# EAGLE design sensor_luz (EAGLE 7.1.0)
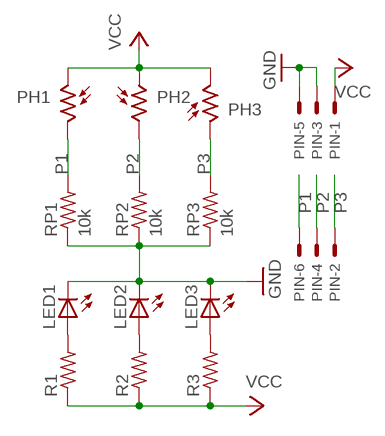
[diagram p0: schematic, sheet 1]

## Parts
LED1  LED3MM  [LED3MM]
LED2  LED3MM  [LED3MM]
LED3  LED3MM  [LED3MM]
PH1  VT20N4  [TO46-VT200]
PH2  VT20N4  [TO46-VT200]
PH3  VT20N4  [TO46-VT200]
PIN  332-06  [332-06]
R1  R-US_0207/7  [0207/7]
R2  R-US_0207/7  [0207/7]
R3  R-US_0207/7  [0207/7]
RP1  10k  R-US_0207/7  [0207/7]
RP2  10k  R-US_0207/7  [0207/7]
RP3  10k  R-US_0207/7  [0207/7]

## Nets
GND: LED1.K(C) LED2.K(C) LED3.K(C) PIN.3 PIN.5 RP1.1 RP2.1 RP3.1
N$1: LED1.A R1.2
N$2: LED2.A R2.2
N$3: LED3.A R3.2
P1: PH1.2 PIN.6 RP1.2
P2: PH2.2 PIN.4 RP2.2
P3: PH3.1 PIN.2 RP3.2
VCC: PH1.1 PH2.1 PH3.2 PIN.1 R1.1 R2.1 R3.1

## Library data of the parts
LED1-LED3 = led:LED: LED OSRAM: - CHIPLED LG R971, LG N971, LY N971, LG Q971, LY Q971, LO R971, LY R971 LH N974, LH R974 LS Q976, LO Q976, LY Q976 LO Q996 - Hyper CHIPLED LW Q18S LB Q993, LB Q99A, LB R99A - SideLED LS A670, LO A670, LY A670, LG A670, LP A670 LB A673, LV A673, LT A673, LW A673 LH A674 LY A675 LS A676, LA A676, LO A676, LY A676, LW A676 LS A679, LY A679, LG A679 - Hyper Micro SIDELED® LS Y876, LA Y876, LO Y876, LY Y876 LT Y87S - SmartLED LW L88C, LW L88S LB L89C, LB L89S, LG L890 LS L89K, LO L89K, LY L89K LS L896, LA L896, LO L896, LY L896 - TOPLED LS T670, LO T670, LY T670, LG T670, LP T670 LSG T670, LSP T670, LSY T670, LOP T670, LYG T670 LG T671, LOG T671, LSG T671 LB T673, LV T673, LT T673, LW T673 LH T674 LS T676, LA T676, LO T676, LY T676, LB T676, LH T676, LSB T676, LW T676 LB T67C, LV T67C, LT T67C, LS T67K, LO T67K, LY T67K, LW E67C LS E67B, LA E67B, LO E67B, LY E67B, LB E67C, LV E67C, LT E67C LW T67C LS T679, LY T679, LG T679 LS T770, LO T770, LY T770, LG T770, LP T770 LB T773, LV T773, LT T773, LW T773 LH T774 LS E675, LA E675, LY E675, LS T675 LS T776, LA T776, LO T776, LY T776, LB T776 LHGB T686 LT T68C, LB T68C - Hyper Mini TOPLED® LB M676 - Mini TOPLED Santana® LG M470 LS M47K, LO M47K, LY M47K Source: http://www.osram.convergy.de LUXEON: - LUMILED® LXK2-PW12-R00, LXK2-PW12-S00, LXK2-PW14-U00, LXK2-PW14-V00 LXK2-PM12-R00, LXK2-PM12-S00, LXK2-PM14-U00 LXK2-PE12-Q00, LXK2-PE12-R00, LXK2-PE12-S00, LXK2-PE14-T00, LXK2-PE14-U00 LXK2-PB12-K00, LXK2-PB12-L00, LXK2-PB12-M00, LXK2-PB14-N00, LXK2-PB14-P00, LXK2-PB14-Q00 LXK2-PR12-L00, LXK2-PR12-M00, LXK2-PR14-Q00, LXK2-PR14-R00 LXK2-PD12-Q00, LXK2-PD12-R00, LXK2-PD12-S00 LXK2-PH12-R00, LXK2-PH12-S00 LXK2-PL12-P00, LXK2-PL12-Q00, LXK2-PL12-R00 Source: www.luxeon.com KINGBRIGHT: KA-3528ASYC Source: www.kingbright.com
PH1-PH3 = photo-elements:VT2*: Photoconductive Cell VT200 Series Source: http://optoelectronics.perkinelmer.com/content/Datasheets/DTS_vt200seriesdatasheet.pdf
PIN = con-garry:332-06: 6 Pin - 2mm Dual Row Source: www.mpe-connector.de / garry_shortform_2012.pdf
R1-R3 RP1-RP3 = rcl:R-US_: RESISTOR, American symbol

## Board
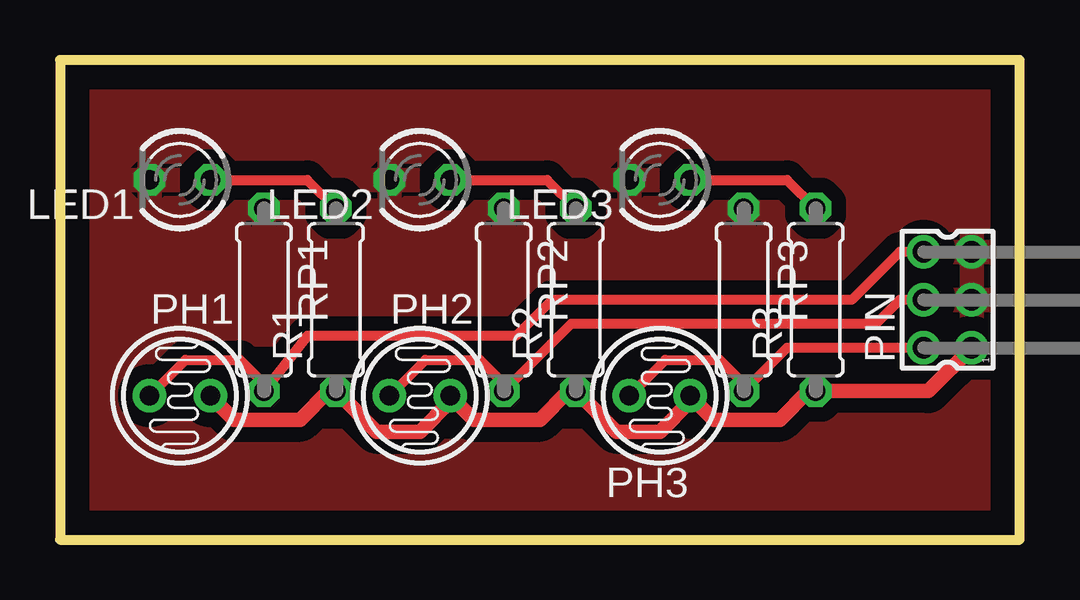
[diagram p1: board, top side]

Size 40 x 20 mm. Coordinates in mm from the lower left corner, seen from the top.
Outline: 0,20 0,0 40,0 40,20 0,20
Copper layers (1*16): Top 0.035mm / dielectric 1.5mm / Bottom 0.035mm
Design rules "default": minimum track width 10mil, minimum drill 24mil, track to track 8mil, track to pad 8mil, pad to pad 8mil, via to via 8mil, smd to smd 8mil, copper to edge 40mil, drill to drill 8mil, minimum pad ring 10mil, minimum via ring 8mil, stop-mask expansion 4mil, vias tented up to drill 0mil, thermal gap 10mil

### Footprints (pad centres in the part's own frame; a part is rotated, then mirrored left to right if it is on the bottom)
LED3MM = drill 0.813 octagon: A -1.27,0; K 1.27,0
TO46-VT200 = drill 0.8 pad 1.4: 1 -1.27,0; 2 1.27,0
332-06 = drill 0.9 pad 1.27: 1 -2,-1; 2 -2,1; 3 0,-1; 4 0,1; 5 2,-1; 6 2,1
0207/7 = drill 0.813 octagon: 1 -3.81,0; 2 3.81,0

### Placement (x,y rotation side)
LED1  5,15 180 top
LED2  15,15 180 top
LED3  25,15 180 top
PH1  5,6 180 top
PH2  15,6 180 top
PH3  25,6 0 top
PIN  37,10 90 top
R1  11.5,10 90 top
R2  21.5,10 90 top
R3  31.5,10 90 top
RP1  8.5,10 270 top
RP2  18.5,10 270 top
RP3  28.5,10 270 top

### Tracks (layer width: path | path; a pad name or v marks a point on that pad's centre or on a via)
GND
  pour Top (isolate 0.61): -1,-1 -1,21 41,21 41,-1
N$1
  Top 0.406: LED1.A 10.31,15 R1.2
N$2
  Top 0.406: LED2.A 20.31,15 R2.2
N$3
  Top 0.406: LED3.A 30.31,15 R3.2
P1
  Top 0.406: PH1.2 5.23,7.5 7.5,7.5 8.5,6.5 RP1.2 10.31,8.5 19,8.5 20.5,10 33,10 35,12 PIN.6
P2
  Top 0.406: PH2.2 15.23,7.5 17.5,7.5 18.5,6.5 RP2.2 21.31,9 34,9 35,10 PIN.4
P3
  Top 0.406: PH3.1 25.23,7.5 27.5,7.5 28.5,6.5 RP3.2 30.31,8 PIN.2
VCC
  Top 0.406: 11.19,6.19 R1.1 | 21.19,6.19 R2.1 | 31.19,6.19 R3.1 | 16.27,5.77 PH2.1 | 26.27,5.77 PH3.2
  Top 0.61: PH1.1 7.27,5 10,5 11.19,6.19 | PH2.1 17.27,5 20,5 21.19,6.19 | PH3.2 27.27,5 30,5 31.19,6.19 | PIN.1 36.19,6.19 R3.1 | R1.1 13.19,4.5 15,4.5 16.27,5.77 | R2.1 23.19,4.5 25,4.5 26.27,5.77